# Altium schematic sheet ENC28J60.SchDoc
size A4
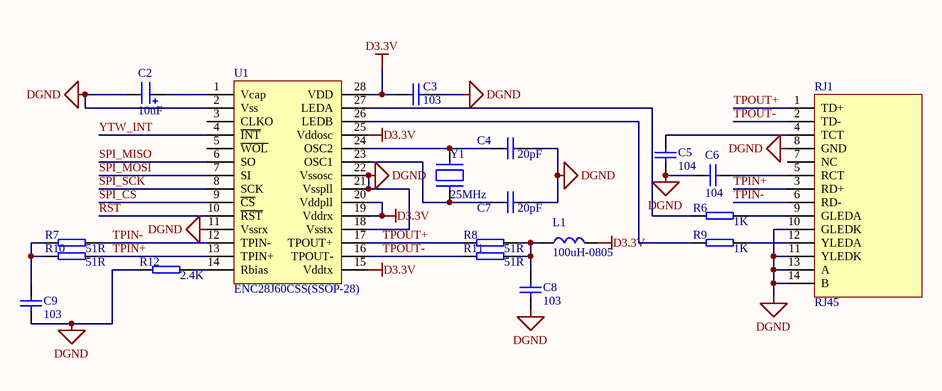
[diagram p0: ENC28J60.SchDoc]

## Parts
C2  10uF  [13*20]
C3  103  [0603C]
C4  20pF  [0603C]
C5  104  [0603C]
C6  104  [0603C]
C7  20pF  [0603C]
C8  103  [0603C]
C9  103  [0603C]
L1  100uH-0805  [0603P]
R6  1K  [0402R]
R7  51R  [0402R]
R8  51R  [0402R]
R9  1K  [0402R]
R10  51R  [0402R]
R11  51R  [0402R]
R12  2.4K  [0402R]
RJ1  RJ45
U1  ENC28J60CSS(SSOP-28)  [ENC28J60-SSOP28_5.3MM]
Y1  25MHz  [XTAL]

## Nets
D3.3V: C3.1 L1.2 U1.15(Vddtx) U1.19(Vddrx) U1.20(Vddpll) U1.25(Vddosc) U1.28(VDD)
DGND: C2.2 C3.2 C4.2 C5.1 C6.1 C7.2 C8.1 C9.1 R12.1 RJ1.8(GND) RJ1.10(GLEDK) RJ1.11(YLEDK) RJ1.13(A) RJ1.14(B) U1.2(Vss) U1.11(Vssrx) U1.18(Vsstx) U1.21(Vsspll) U1.22(Vssosc)
RST: U1.10(~{RST})
SPI_CS: U1.9(~{CS})
SPI_MISO: U1.6(SO)
SPI_MOSI: U1.7(SI)
SPI_SCK: U1.8(SCK)
TPIN+: R10.2 RJ1.3(RD+) U1.13(TPIN+)
TPIN-: R7.2 RJ1.6(RD-) U1.12(TPIN-)
TPOUT+: R8.1 RJ1.1(TD+) U1.17(TPOUT+)
TPOUT-: R11.1 RJ1.2(TD-) U1.16(TPOUT-)
YTW_INT: U1.4(~{INT})
NetC2_1: C2.1 U1.1(Vcap)
NetC4_1: C4.1 U1.24(OSC2) Y1.2
NetC5_2: C5.2 RJ1.4(TCT)
NetC6_2: C6.2 RJ1.5(RCT)
NetC7_1: C7.1 U1.23(OSC1) Y1.1
NetC8_2: C8.2 L1.1 R8.2 R11.2
NetC9_2: C9.2 R7.1 R10.1
NetR6_1: R6.1 U1.27(LEDA)
NetR6_2: R6.2 RJ1.9(GLEDA)
NetR9_1: R9.1 U1.26(LEDB)
NetR9_2: R9.2 RJ1.12(YLEDA)
NetR12_2: R12.2 U1.14(Rbias)

Not connected (* = marked no-connect by the designer): RJ1 7(NC); U1 3(CLKO) 5(~{WOL})

## Library data of the parts
C2 = Cap_pol: 直插电解电容
C3-C9 = Cap: 贴片电容
L1 = L
R6-R12 = RES-10K
RJ1 = RJ45: 网络变压器
U1 = ENC28J60CSS(SSOP-28): 10M以太网芯片
Y1 = XTAL: 8M